# Altium schematic sheet ports.SchDoc
size A4
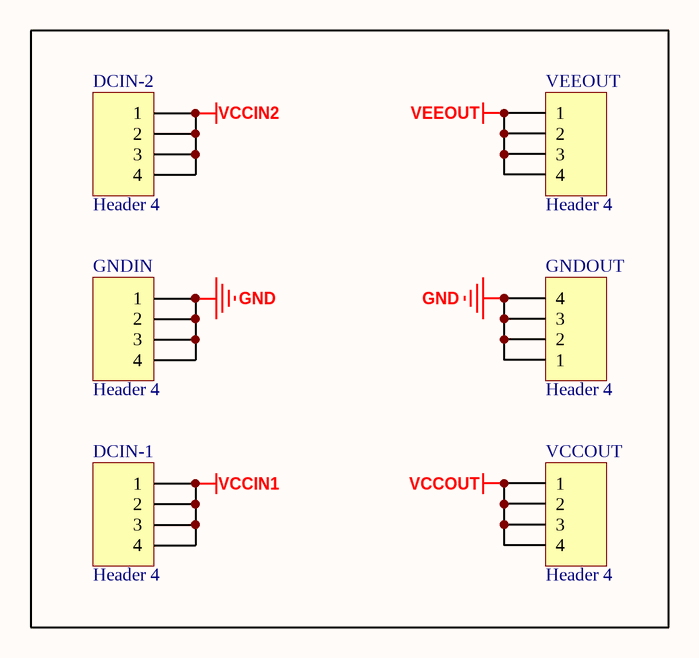
[diagram p0: ports.SchDoc]

## Parts
DCIN-1  Header 4  [HDR1X4]
DCIN-2  Header 4  [HDR1X4]
GNDIN  Header 4  [HDR1X4]
GNDOUT  Header 4  [HDR1X4]
VCCOUT  Header 4  [HDR1X4]
VEEOUT  Header 4  [HDR1X4]

## Nets
GND: GNDIN.1 GNDIN.2 GNDIN.3 GNDIN.4 GNDOUT.1 GNDOUT.2 GNDOUT.3 GNDOUT.4
VCCIN1: DCIN-1.1 DCIN-1.2 DCIN-1.3 DCIN-1.4
VCCIN2: DCIN-2.1 DCIN-2.2 DCIN-2.3 DCIN-2.4
VCCOUT: VCCOUT.1 VCCOUT.2 VCCOUT.3 VCCOUT.4
VEEOUT: VEEOUT.1 VEEOUT.2 VEEOUT.3 VEEOUT.4

## Library data of the parts
DCIN-1 DCIN-2 GNDIN GNDOUT VCCOUT VEEOUT = Header 4: Header, 4-Pin; LatestRevisionDate: 17-Jul-2002; LatestRevisionNote: Re-released for DXP Platform.; Publisher: Altium Limited